# EAGLE design pixel-power-injection-v1b (EAGLE 8.6.0)
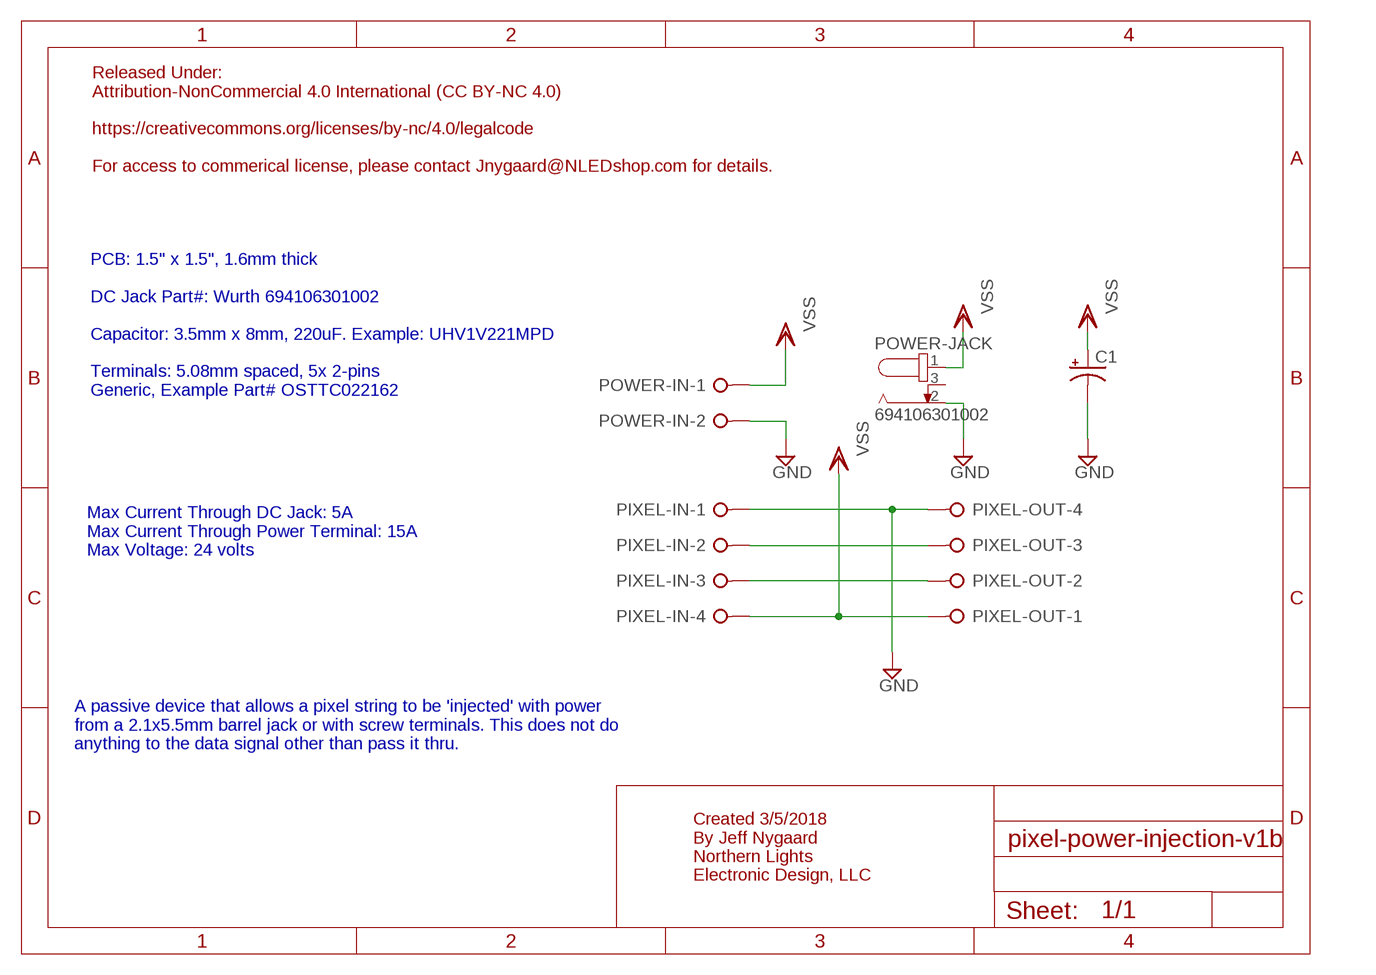
[diagram p0: schematic, sheet 1]

## Parts
C1  CPOL-USE3.5-8  [E3,5-8]
PIXEL-IN  W237-04P  [W237-4P]
PIXEL-OUT  W237-04P  [W237-4P]
POWER-IN  W237-02P  [W237-132]
POWER-JACK  694106301002  [694106301002]

## Nets
GND: C1.- PIXEL-IN.1 PIXEL-OUT.4 POWER-IN.2 POWER-JACK.2
N$2: PIXEL-IN.3 PIXEL-OUT.2
N$3: PIXEL-IN.2 PIXEL-OUT.3
VSS: C1.+ PIXEL-IN.4 PIXEL-OUT.1 POWER-IN.1 POWER-JACK.1
Unconnected: POWER-JACK.3

## Notes on the sheet
- Released Under:
  Attribution-NonCommercial 4.0 International (CC BY-NC 4.0)
  
  https://creativecommons.org/licenses/by-nc/4.0/legalcode
  
  For access to commerical license, please contact Jnygaard@NLEDshop.com for details.
- PCB: 1.5" x 1.5", 1.6mm thick
  
  DC Jack Part#: Wurth 694106301002
  
  Capacitor: 3.5mm x 8mm, 220uF. Example: UHV1V221MPD
  
  Terminals: 5.08mm spaced, 5x 2-pins
  Generic, Example Part# OSTTC022162
- Max Current Through DC Jack: 5A
  Max Current Through Power Terminal: 15A
  Max Voltage: 24 volts
- A passive device that allows a pixel string to be 'injected' with power
  from a 2.1x5.5mm barrel jack or with screw terminals. This does not do
  anything to the data signal other than pass it thru.
- Created 3/5/2018
  By Jeff Nygaard
  Northern Lights
  Electronic Design, LLC

## Library data of the parts
C1 = rcl:CPOL-US: POLARIZED CAPACITOR, American symbol
PIXEL-IN PIXEL-OUT = con-wago-508:W237-04P: WAGO SREW CLAMP; OC_FARNELL: unknown; OC_NEWARK: unknown
POWER-IN = con-wago-508:W237-02P: WAGO SREW CLAMP; OC_FARNELL: unknown; OC_NEWARK: unknown
POWER-JACK = Wurth_Elektronik_Electromechanic_DC_Power_Jack_Connectors_rev15c:694106301002: WR-DC_DC Power Jack_Right Angled_THT Center Pin Ø2.0_Plug ID Ø2.05_Plug OD Ø5.5 ;=>Code : Con_WR-DC_THT_694108301002_694106301002 <http://katalog.we-online.de/media/images/eican/Con_WR-DC_THT_694108301002_pf2.jpg> Details see: http://katalog.we-online.de/em/datasheet/6941xx301002.pdf Created 2014-10-08, Karrer Zheng 2014 (C) Wurth Elektronik

## Board
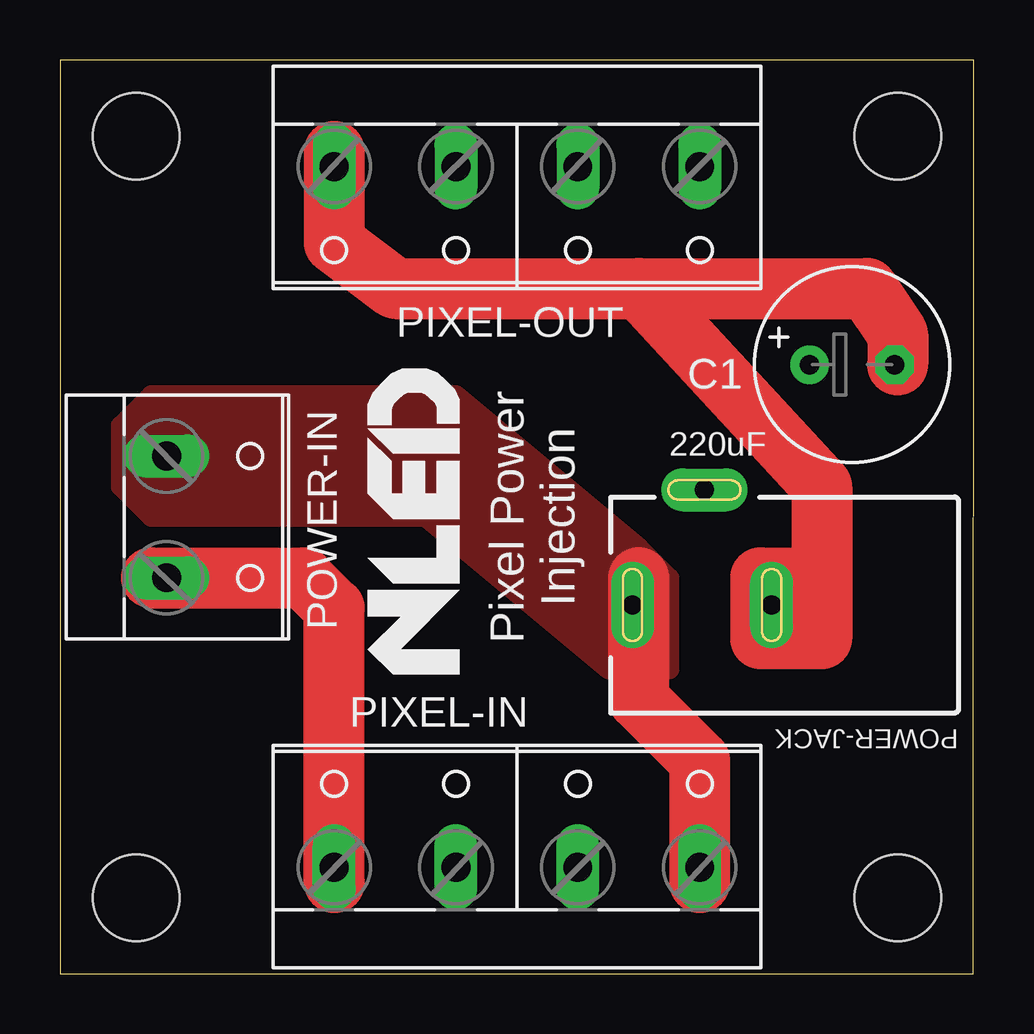
[diagram p1: board, top side]
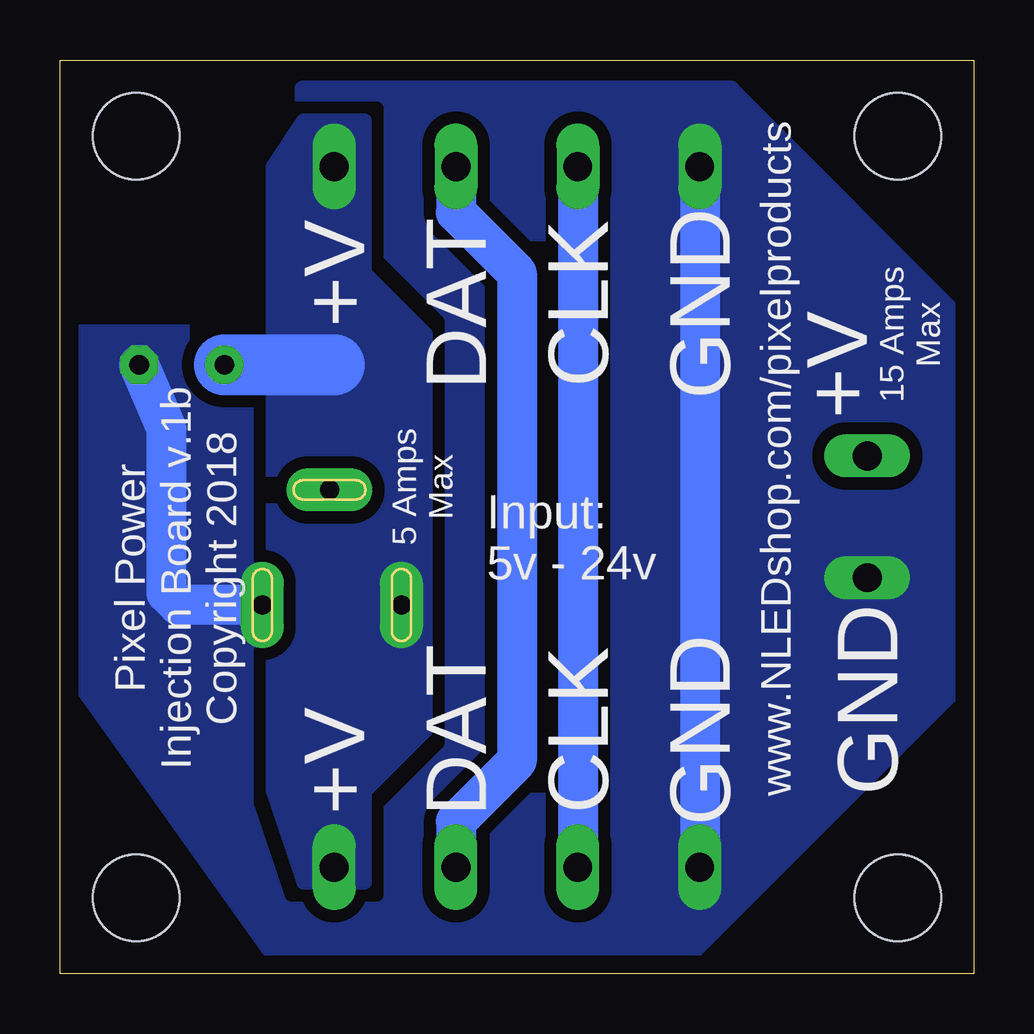
[diagram p2: board, bottom side, seen from below]

Size 38.1 x 38.1 mm. Coordinates in mm from the lower left corner, seen from the top.
Outline: 0,0 38.08,0 38.1,38.1 0,38.1 0,0
Copper layers (1*16): Top 0.035mm / dielectric 1.5mm / Bottom 0.035mm
Design rules "SeeedStudio_2layer_DRU_no_angle_20140221 *": minimum track width 6mil, minimum drill 12mil, track to track 20mil, track to pad 20mil, pad to pad 6mil, via to via 6mil, smd to smd 0mil, copper to edge 30mil, drill to drill 30mil, minimum pad ring 10mil, minimum via ring 6mil, stop-mask expansion 2mil, vias tented up to drill 100mil, thermal gap 10mil
Holes 3.6 mm at 3.17,3.17 34.92,3.17 34.92,34.92 3.17,34.92

### Footprints (pad centres in the part's own frame; a part is rotated, then mirrored left to right if it is on the bottom)
E3,5-8 = drill 0.813 pad 1.6: + -1.778,0 | drill 0.813 pad 1.6 octagon: - 1.778,0
W237-4P = drill 1.194 long: 1 -7.62,-0.635; 2 -2.54,-0.635; 3 2.54,-0.635; 4 7.62,-0.635
W237-132 = drill 1.194 long: 1 -2.54,-0.635; 2 2.54,-0.635
694106301002 = drill 0.8 pad 1.8 long: 1 -13.6,-2.4; 2 -7.8,-2.4; 3 -10.6,2.4

### Placement (x,y rotation side)
C1  33.02,25.4 0 top
PIXEL-IN  19.05,5.08 0 top
PIXEL-OUT  19.05,33.02 180 top
POWER-IN  5.08,19.05 270 top
POWER-JACK  37.47,17.78 0 top

### Tracks (layer width: path | path; a pad name or v marks a point on that pad's centre or on a via)
GND
  Bottom 1.676: PIXEL-OUT.4 PIXEL-IN.1 | POWER-JACK.2 33.16,15.38 33.66,15.88 33.66,22.73 C1.-
  pour Bottom (rank 2, no thermals): 30.48,26.67 38.1,26.67 38.1,13.34 28.57,0 12.7,0 0,12.7 0,26.67 10.16,36.83 27.94,36.83 30.48,31.75
N$1
  Top 2.54: 3.81,16.51 10.16,16.51 11.43,15.24 11.43,3.81
N$2
  Bottom 1.676: PIXEL-OUT.2 21.59,31.75 19.05,29.21 19.05,8.89 21.59,6.35 PIXEL-IN.3
N$3
  Bottom 1.676: PIXEL-OUT.3 PIXEL-IN.2
N$4
  Top 2.54: 11.43,34.29 11.43,30.48 13.97,28.57 24.13,28.57 | 24.13,28.57 31.75,20.32 31.75,16.51 | 31.75,16.51 31.75,13.97 29.21,13.97 29.21,16.51 31.75,16.51 | 24.13,28.57 33.66,28.57 34.92,26.67 34.92,25.4
VSS
  Top 2.54: 26.67,3.81 26.67,8.89 24.13,11.43 24.13,16.51
  Bottom 2.54: C1.+ 26.67,25.4
  pour Bottom (no thermals): 25.4,35.56 25.4,29.21 22.86,26.67 22.86,10.16 25.4,7.62 25.4,3.81 27.94,3.81 29.21,7.62 29.21,33.66 27.94,35.56
  pour Top (no thermals): 3.81,24.13 16.51,24.13 24.13,17.78 25.4,16.51 25.4,12.7 22.86,12.7 15.24,19.05 3.81,19.05 2.54,20.32 2.54,22.86

### Text on the board
tNames: 220uF | Pixel Power / Injection
bNames: www.NLEDshop.com/pixelproducts | +V | GND | CLK | DAT | 15 Amps / Max | +V | 5 Amps / Max | Input: / 5v - 24v | Pixel Power / Injection Board v.1b / Copyright 2018 | GND | GND | CLK | DAT | +V
tDocu: +V | GND | +V | GND | GND | +V